# Altium project PCB_QrCodeMCU.PrjPcb (part 1 of 2)
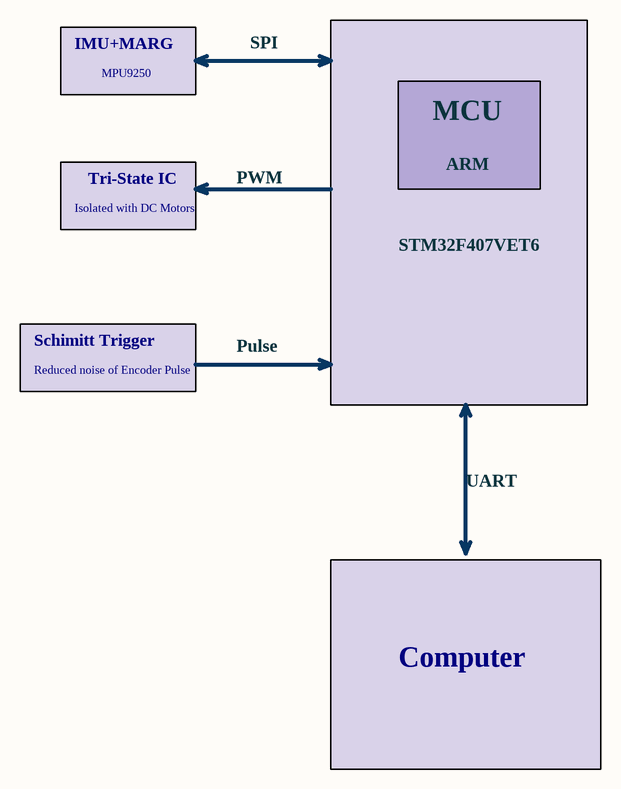
[diagram p0: Block_Diagram.SchDoc]
6 sheets, 101 parts. Net scope: flat (ports and power ports of the same name join across sheets).
Board file: PCB2.PcbDoc
Sheets:
  Block_Diagram.SchDoc
  PowerDiagram.SchDoc
  Power.SchDoc
  MCU.SchDoc
  Motor.SchDoc
  IMU.SchDoc

## Sheet Block_Diagram.SchDoc
size A; SheetNumber: 1; SheetTotal: 6

### Notes on the sheet
- IMU+MARG
- MPU9250
- SPI
- MCU
- ARM
- Isolated with DC Motors
- Tri-State IC
- PWM
- STM32F407VET6
- Schimitt Trigger
- Reduced noise of Encoder Pulse
- Pulse
- UART
- Computer

## Sheet PowerDiagram.SchDoc
size A; SheetNumber: 2; SheetTotal: 6
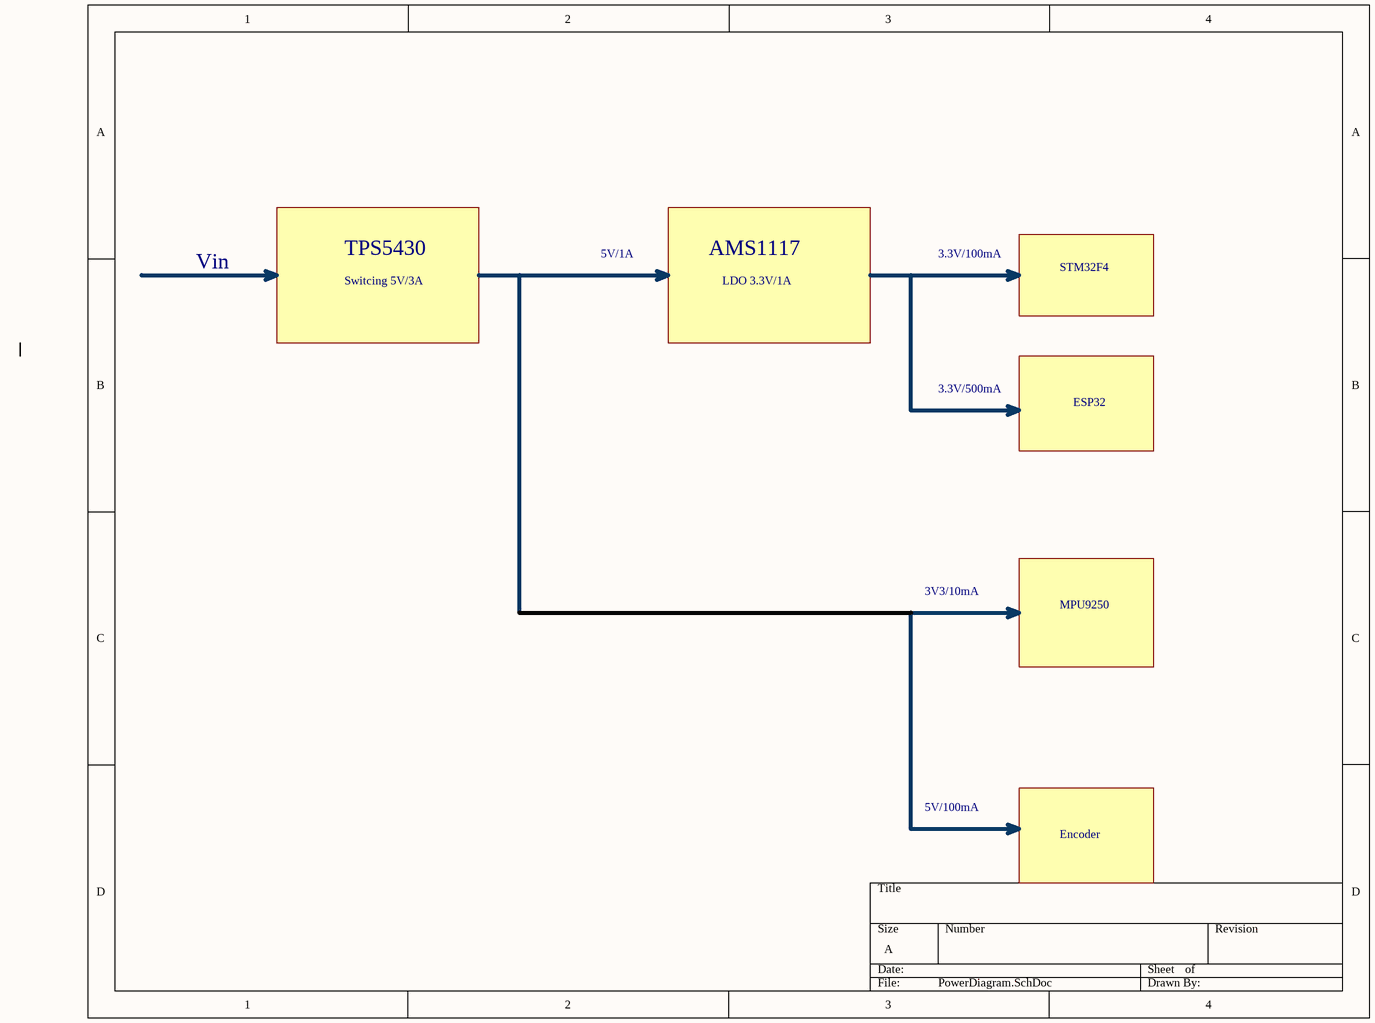
[diagram p1: PowerDiagram.SchDoc]

### Notes on the sheet
- Vin
- TPS5430
- Switcing 5V/3A
- 5V/1A
- AMS1117
- LDO 3.3V/1A
- 3.3V/100mA
- STM32F4
- 3.3V/500mA
- ESP32
- 3V3/10mA
- MPU9250
- 5V/100mA
- Encoder

## Sheet Power.SchDoc
size A3; SheetNumber: 3; SheetTotal: 6
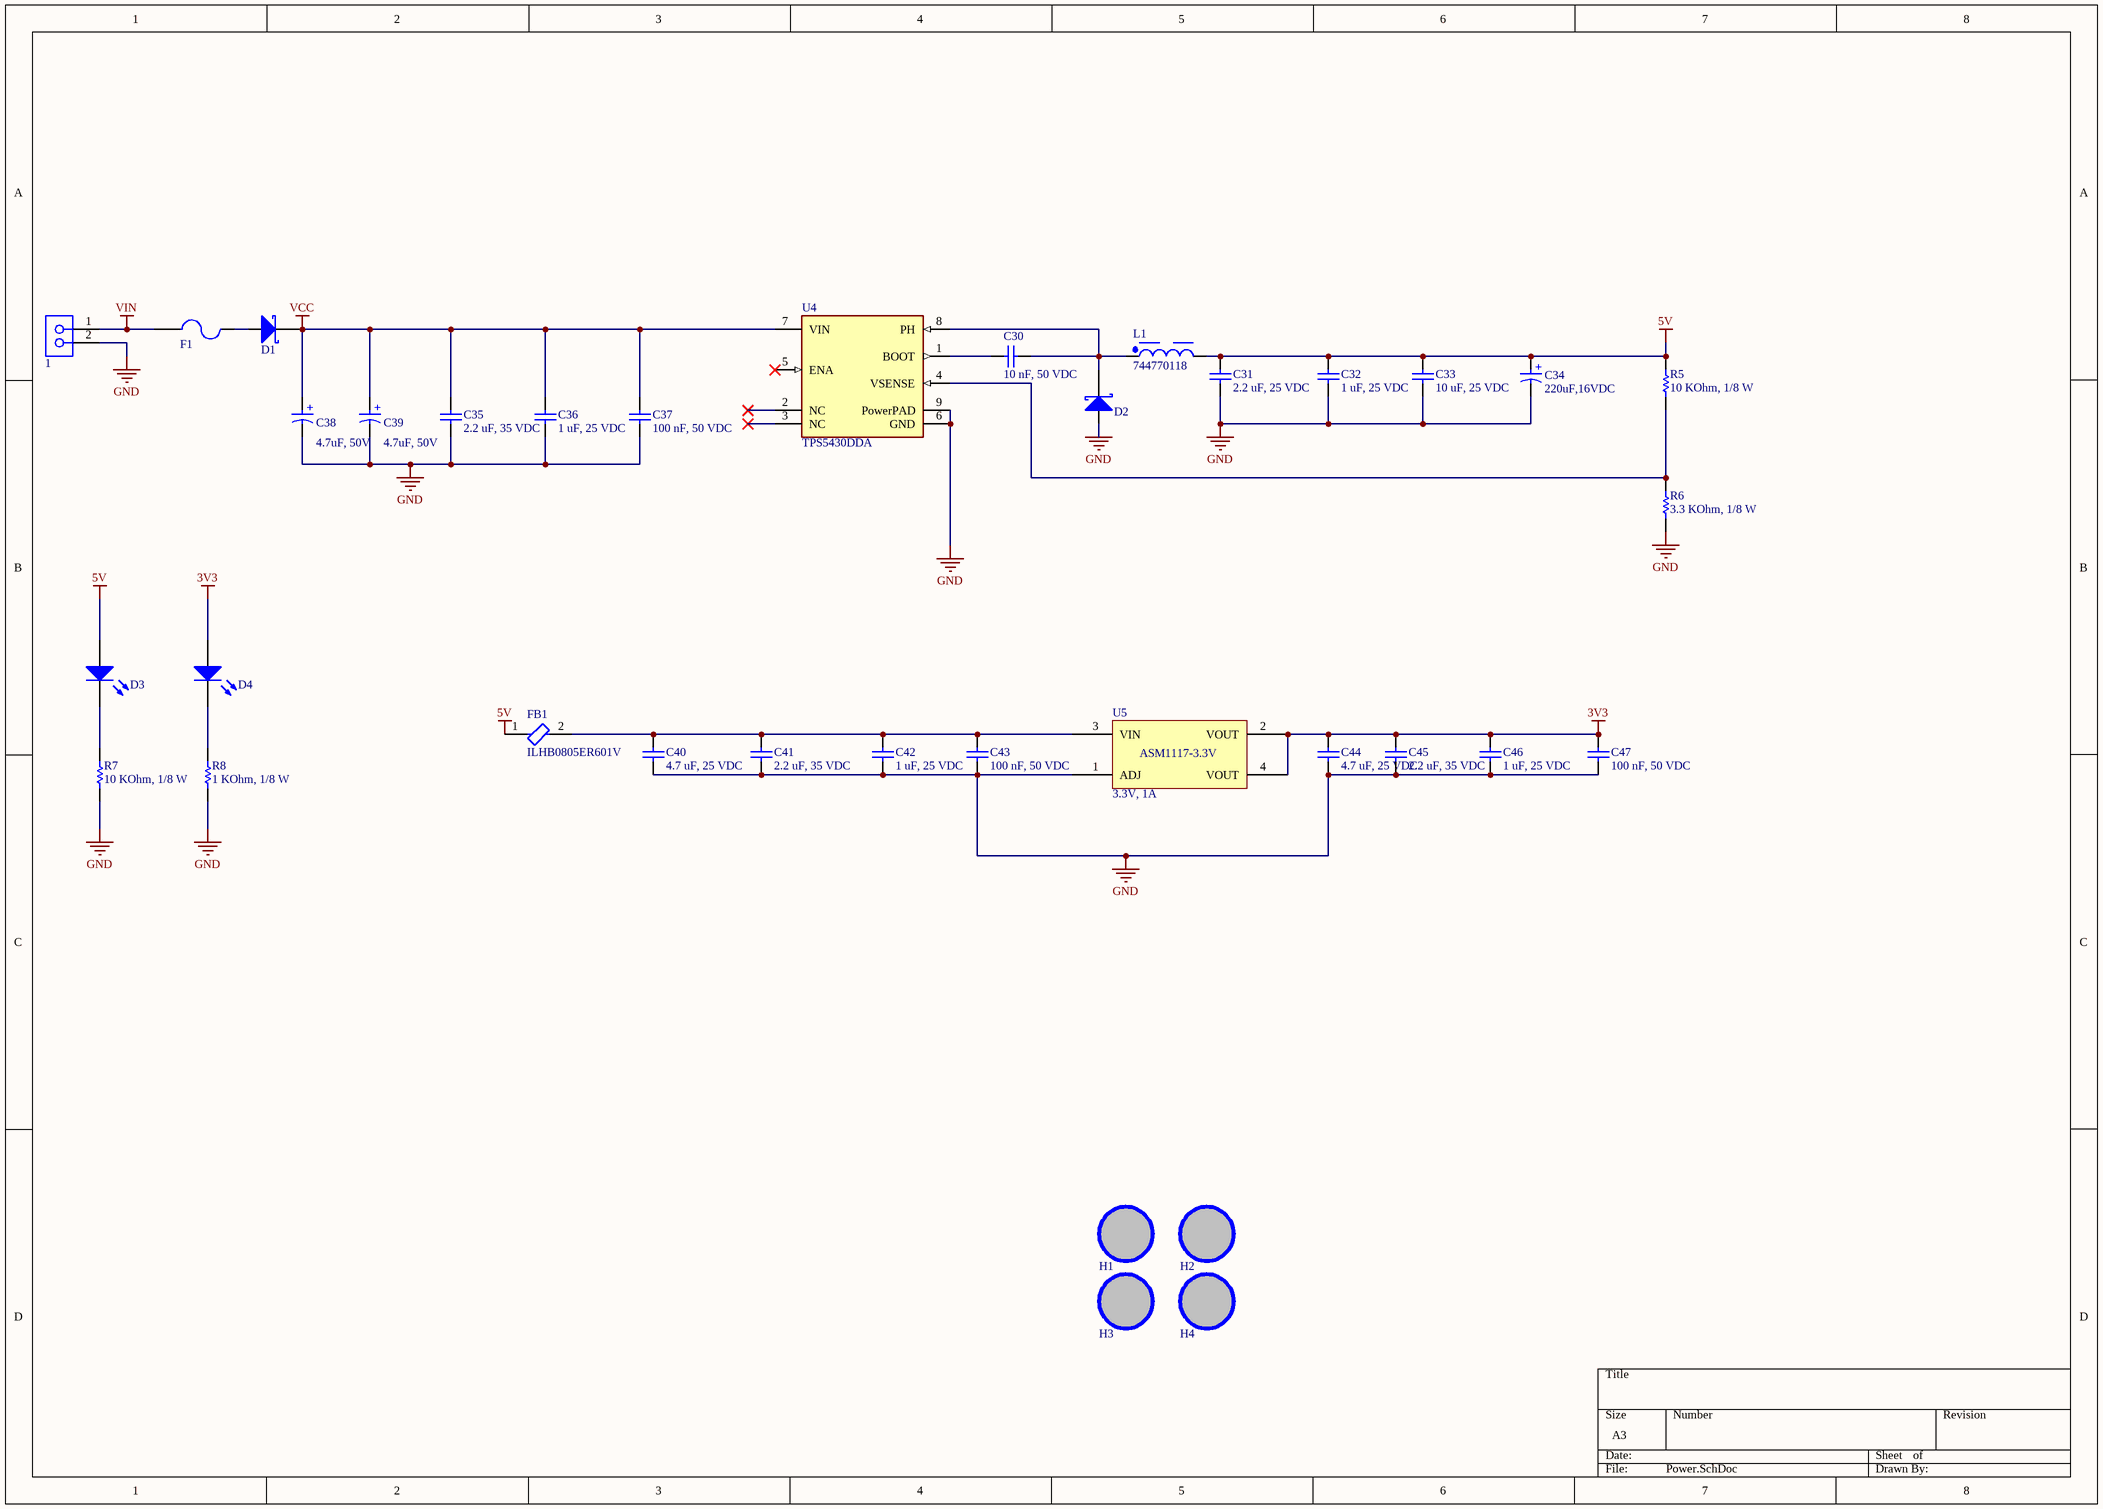
[diagram p2: Power.SchDoc]

### Parts
1  4A, 300V  [691418420002]  (value not drawn)
C30  10 nF, 50 VDC  [CAP_0805]
C31  2.2 uF, 25 VDC  [CAP_0805]
C32  1 uF, 25 VDC  [CAP_0805]
C33  10 uF, 25 VDC  [CAP_0805]
C34  220uF,16VDC  [WCAP-ASLI_D6.3H7.7]
C35  2.2 uF, 35 VDC  [CAP_0805]
C36  1 uF, 25 VDC  [CAP_0805]
C37  100 nF, 50 VDC  [CAP_0805]
C38  4.7uF, 50V  [WCAP-ASLI_D4H5.5]
C39  4.7uF, 50V  [WCAP-ASLI_D4H5.5]
C40  4.7 uF, 25 VDC  [CAP_0805]
C41  2.2 uF, 35 VDC  [CAP_0805]
C42  1 uF, 25 VDC  [CAP_0805]
C43  100 nF, 50 VDC  [CAP_0805]
C44  4.7 uF, 25 VDC  [CAP_0805]
C45  2.2 uF, 35 VDC  [CAP_0805]
C46  1 uF, 25 VDC  [CAP_0805]
C47  100 nF, 50 VDC  [CAP_0805]
D1  D Schottky  [SS34]  (value not drawn)
D2  D Schottky  [SS34]  (value not drawn)
D3  LED SMD  [LED_0805_Blue]  (value not drawn)
D4  LED SMD  [LED_0805_Blue]  (value not drawn)
F1  Fuse  [FUSE SMD]  (value not drawn)
FB1  ILHB0805ER601V  [FP-ILHB-0805-IPC_C]
H1  Hole  [LO KHOAN 3MM]  (value not drawn)
H2  Hole  [LO KHOAN 3MM]  (value not drawn)
H3  Hole  [LO KHOAN 3MM]  (value not drawn)
H4  Hole  [LO KHOAN 3MM]  (value not drawn)
L1  744770118  [WE-PD_1280]
R5  10 KOhm, 1/8 W  [RESISTOR_0805]
R6  3.3 KOhm, 1/8 W  [RESISTOR_0805]
R7  10 KOhm, 1/8 W  [RESISTOR_0805]
R8  1 KOhm, 1/8 W  [RESISTOR_0805]
U4  TPS5430DDA  [FP-DDA0008J-MFG]
U5  3.3V, 1A  [AMS1117-3.3V SOT223]

### Nets
3V3: C44.2 C45.2 C46.2 C47.2 D4.1(A) U5.2(VOUT) U5.4(VOUT)
5V: C31.2 C32.2 C33.2 C34.1(P) D3.1(A) FB1.1 L1.2 R5.2
GND: 1.2 C31.1 C32.1 C33.1 C34.2(N) C35.1 C36.1 C37.1 C38.2(N) C39.2(N) C40.1 C41.1 C42.1 C43.1 C44.1 C45.1 C46.1 C47.1 D2.1(A) R6.1 R7.1 R8.1 U4.6(GND) U4.9(PowerPAD) U5.1(ADJ)
VCC: C35.2 C36.2 C37.2 C38.1(P) C39.1(P) D1.2(K) U4.7(VIN)
VIN: 1.1 F1.1
NetC30_1: C30.1 D2.2(K) L1.1 U4.8(PH)
NetC30_2: C30.2 U4.1(BOOT)
NetC40_2: C40.2 C41.2 C42.2 C43.2 FB1.2 U5.3(VIN)
NetD1_1: D1.1(A) F1.2
NetD3_2: D3.2(K) R7.2
NetD4_2: D4.2(K) R8.2
NetR5_1: R5.1 R6.2 U4.4(VSENSE)

Not connected (* = marked no-connect by the designer): H1 1; H2 1; H3 1; H4 1; U4 2(NC)* 3(NC)* 5(ENA)*

### Notes on the sheet
- (in symbol 865080345012) +
- (in symbol 865080640004) +
- (in symbol AMS1117-3.3V) ASM1117-3.3V

### Library data of the parts
1 = 691418420002: WR-TBL Series 4184 45° Entry, THT, pitch 7.62mm, 2p; Manufacturer: Wurth Elektronik; Modularity: No; ComponentLink1Description: Datasheet Link; ComponentLink1URL: https://www.we-online.com/redexpert/spec/691418420002?ad; ComponentLink2Description: Supplier 1 URL; ComponentLink2URL: N/A; Manufacturer Part Number: 691418420002; Category: Terminal Blocks; Match Code: WR-TBL; Mount: Through Hole; Operating Temperature Max: 120°C; Operating Temperature Min: -30°C; Packaging: Box; Application: Screwless; Number of Pins: 2; Number of Rows: 1; Orientation: 45°; Pitch: 7.62mm; Rated Current: 4A; Working Voltage: 300V; ComponentLink3Description: Supplier 2 URL; ComponentLink3URL: N/A; ComponentLink4Description: Supplier 3 URL; ComponentLink4URL: https://www.thegioiic.com/hb762-2-terminal-khoi-han-pcb-2-cuc-24a-450v-7-62mm; Supplier 1 Name: Mouser; Supplier 1 SN: N/A; Supplier 1 URL: N/A; Supplier 2 Name: Digi-Key; Supplier 2 SN: N/A; Supplier 2 URL: N/A; Supplier 3 Name: thegioiic; Supplier 3 SN: N/A; Supplier 3 URL: https://www.thegioiic.com/hb762-2-terminal-khoi-han-pcb-2-cuc-24a-450v-7-62mm; Value: 4A, 300V
C30 = 0108051031050: CAP, size 0805, 10 nF, 50 VDC; Manufacture Name: TDK; Manufacture SN: CGA4C2C0G1H103J060AA; Capacitance: 10 nF; Tolerance: +/-5%; Voltage Rating DC: 50 VDC; ComponentLink2Description: Datasheet; ComponentLink2URL: https://product.tdk.com/system/files/dam/doc/product/capacitor/ceramic/mlcc/catalog/mlcc_automotive_general_en.pdf?ref_disty=mouser; Operating Temperature: -55 to +125degC; Packaging: Tape and Reel; Mounting Technology: SMT; Size: 0805; Supplier 1 Name: Mouser; Supplier 1 SN: 810-CGA4C2C0G1H103J; Supplier 1 URL: https://www.mouser.vn/ProductDetail/TDK/CGA4C2C0G1H103J060AA?qs=FxQuwy19cyC9M6v0nMqjhA%3D%3D&utm_source=mouser-refine-download&utm_medium=file&utm_campaign=CGA4C2C0G1H103J060AA&utm_content=TDK; Supplier 2 Name: Digi-Key; Supplier 2 SN: 445-6947-2-ND; Supplier 2 URL: https://www.digikey.com/en/products/detail/tdk-corporation/cga4c2c0g1h103j060aa/2672840; Supplier 3 Name: thegioiic; Supplier 3 SN: OEM; Supplier 3 URL: N/A; Value: 10 nF, 50 VDC
C31 = 0108052251025: CAP, size 0805, 2.2 uF, 25 VDC; Manufacture Name: TDK; Manufacture SN: CGA4J3X7R1E225K125AD; Capacitance: 2.2 uF; Tolerance: +/-10%; Voltage Rating DC: 25 VDC; ComponentLink2Description: Datasheet; ComponentLink2URL: https://product.tdk.com/system/files/dam/doc/product/capacitor/ceramic/mlcc/catalog/mlcc_automotive_epoxy_en.pdf?ref_disty=mouser; Operating Temperature: -55 to +125degC; Packaging: Tape and Reel; Mounting Technology: SMT; Size: 0805; Supplier 1 Name: Mouser; Supplier 1 SN: 810-CGA4J3X7R1E225KD; Supplier 1 URL: https://www.mouser.vn/ProductDetail/TDK/CGA4J3X7R1E225K125AD?qs=xLDY6iXSiQZ6drRfaPQTzQ%3D%3D&utm_source=mouser-refine-download&utm_medium=file&utm_campaign=CGA4J3X7R1E225K125AD&utm_content=TDK; Supplier 2 Name: Digi-Key; Supplier 2 SN: 445-9923-2-ND; Supplier 2 URL: https://www.digikey.com/en/products/detail/tdk-corporation/cga4j3x7r1e225k125ad/3933656; Supplier 3 Name: thegioiic; Supplier 3 SN: OEM; Supplier 3 URL: N/A; Value: 2.2 uF, 25 VDC
C32 C36 C42 C46 = 0108051051025: CAP, size 0805, 1 uF, 25 VDC; Manufacture Name: TDK; Manufacture SN: CGA4J1X8R1E105K125AE; Capacitance: 1 uF; Tolerance: +/-10%; Voltage Rating DC: 25 VDC; ComponentLink2Description: Datasheet; ComponentLink2URL: https://product.tdk.com/system/files/dam/doc/product/capacitor/ceramic/mlcc/catalog/mlcc_automotive_soft_en.pdf?ref_disty=mouser; Operating Temperature: -55 to +125degC; Packaging: Tape and Reel; Mounting Technology: SMT; Size: 0805; Supplier 1 Name: Mouser; Supplier 1 SN: 810-A4J1X815K125AE; Supplier 1 URL: https://www.mouser.vn/ProductDetail/TDK/CGA4J1X8R1E105K125AE?qs=Ii670aiJhr6VRhkBsruYJg%3D%3D&utm_source=mouser-refine-download&utm_medium=file&utm_campaign=CGA4J1X8R1E105K125AE&utm_content=TDK; Supplier 2 Name: Digi-Key; Supplier 2 SN: 445-174807-2-ND; Supplier 2 URL: https://www.digikey.com/en/products/detail/tdk-corporation/cga4j1x8r1e105k125ae/6556490; Supplier 3 Name: thegioiic; Supplier 3 SN: OEM; Supplier 3 URL: N/A; Value: 1 uF, 25 VDC
C33 = 0108051061025: CAP, size 0805, 10 uF, 25 VDC; Manufacture Name: TDK; Manufacture SN: CGA4J1X7S1E106K125AE; Capacitance: 10 uF; Tolerance: +/-10%; Voltage Rating DC: 25 VDC; ComponentLink2Description: Datasheet; ComponentLink2URL: https://product.tdk.com/system/files/dam/doc/product/capacitor/ceramic/mlcc/catalog/mlcc_automotive_soft_en.pdf?ref_disty=mouser; Operating Temperature: -55 to +125degC; Packaging: Tape and Reel; Mounting Technology: SMT; Size: 0805; Supplier 1 Name: Mouser; Supplier 1 SN: 810-CGA4J1X7S1E106K2; Supplier 1 URL: https://www.mouser.vn/ProductDetail/TDK/CGA4J1X7S1E106K125AE?qs=PqoDHHvF64%252BJvhmUzM2odA%3D%3D&utm_source=mouser-refine-download&utm_medium=file&utm_campaign=CGA4J1X7S1E106K125AE&utm_content=TDK; Supplier 2 Name: Digi-Key; Supplier 2 SN: 445-181411-2-ND; Supplier 2 URL: https://www.digikey.com/en/products/detail/tdk-corporation/cga4j1x7s1e106k125ae/9744777; Supplier 3 Name: thegioiic; Supplier 3 SN: OEM; Supplier 3 URL: N/A; Value: 10 uF, 25 VDC
C34 = 865080345012: V-Chip, D6.3 x H7.7mm, 220uF, 16V; Manufacturer: Wurth Elektronik; Capacitance Tolerance: +/-20%; Dissipation Factor: 16%; Endurance: 2000h; Leakage Current: 35.2uA; Ripple Current: 275mA; Category: Aluminum Electrolytic Capacitors; ComponentLink2Description: Datasheet Link; ComponentLink2URL: https://www.we-online.com/redexpert/spec/865080345012?ad; Mount: Surface Mount; Operating Temperature Max: 105°C; Operating Temperature Min: -55°C; Packaging: Tape and Reel; Height: 7.7mm; Diameter: 6.3mm; Capacitance: 220uF; Rated Voltage (DC): 16V; Supplier 1 Name: Mouser; Supplier 1 SN: 710-865080345012; Supplier 1 URL: https://www.mouser.com/ProductDetail/Wurth-Elektronik/865080345012?qs=0KOYDY2FL28fdpLe2qFZOQ%3D%3D; Supplier 3 Name: thegioiic; Supplier 3 URL: https://www.thegioiic.com/tu-nhom-smd-220uf-16v-6-3x7-7mm; Manufacturer Part Number: N/A; Supplier 2 Name: Digi-Key; Supplier 2 SN: N/A; Supplier 2 URL: N/A; Supplier 3 SN: N/A; Value: 220uF, 16V
C35 C41 C45 = 0108052251035: CAP, size 0805, 2.2 uF, 35 VDC; Manufacture Name: TDK; Manufacture SN: CGA4J1X7R1V225K125AC; Capacitance: 2.2 uF; Tolerance: +/-10%; Voltage Rating DC: 35 VDC; ComponentLink2Description: Datasheet; ComponentLink2URL: https://product.tdk.com/system/files/dam/doc/product/capacitor/ceramic/mlcc/catalog/mlcc_automotive_general_en.pdf?ref_disty=mouser; Operating Temperature: -55 to +125degC; Packaging: Tape and Reel; Mounting Technology: SMT; Size: 0805; Supplier 1 Name: Mouser; Supplier 1 SN: 810-CGA4J1X7R1V225K; Supplier 1 URL: https://www.mouser.vn/ProductDetail/TDK/CGA4J1X7R1V225K125AC?qs=NRhsANhppD%2FTd0jz18r29g%3D%3D&utm_source=mouser-refine-download&utm_medium=file&utm_campaign=CGA4J1X7R1V225K125AC&utm_content=TDK; Supplier 2 Name: Digi-Key; Supplier 2 SN: 445-6963-2-ND; Supplier 2 URL: https://www.digikey.com/en/products/detail/tdk-corporation/cga4j1x7r1v225k125ac/2672856; Supplier 3 Name: thegioiic; Supplier 3 SN: OEM; Supplier 3 URL: N/A; Value: 2.2 uF, 35 VDC
C37 C43 C47 = 0108051041050: CAP, size 0805, 100 nF, 50 VDC; Manufacture Name: TDK; Manufacture SN: CGA4J2X8R1H104K125AD; Capacitance: 0.1 nF; Tolerance: +/-10%; Voltage Rating DC: 50 VDC; Value: 0.1 nF, 50 VDC; ComponentLink2Description: Datasheet; ComponentLink2URL: https://product.tdk.com/system/files/dam/doc/product/capacitor/ceramic/mlcc/catalog/mlcc_automotive_epoxy_en.pdf?ref_disty=mouser; Operating Temperature: -55 to +125degC; Packaging: Tape and Reel; Mounting Technology: SMT; Size: 0805; Supplier 1 Name: Mouser; Supplier 1 SN: 810-C2012X8R1H104KEP; Supplier 1 URL: https://www.mouser.vn/ProductDetail/TDK/CGA4J2X8R1H104K125AD?qs=LcTL%2F5vFEzExqZqv3rh1qQ%3D%3D&utm_source=mouser-refine-download&utm_medium=file&utm_campaign=CGA4J2X8R1H104K125AD&utm_content=TDK; Supplier 2 Name: Digi-Key; Supplier 2 SN: 445-8810-2-ND; Supplier 2 URL: https://www.digikey.com/en/products/detail/tdk-corporation/cga4j2x8r1h104k125ad/3248169; Supplier 3 Name: thegioiic; Supplier 3 SN: OEM; Supplier 3 URL: N/A
C38 C39 = 865080640004: V-Chip, D4 x H5.5mm, 4.7uF, 50V; Manufacturer: Wurth Elektronik; Capacitance Tolerance: +/-20%; Dissipation Factor: 12%; Endurance: 2000h; Leakage Current: 3uA; Ripple Current: 55mA; Category: Aluminum Electrolytic Capacitors; ComponentLink2Description: Datasheet Link; ComponentLink2URL: https://www.we-online.com/redexpert/spec/865080640004?ad; Mount: Surface Mount; Operating Temperature Max: 105°C; Operating Temperature Min: -55°C; Packaging: Tape and Reel; Height: 5.5mm; Diameter: 4mm; Capacitance: 4.7uF; Rated Voltage (DC): 50V; Supplier 1 Name: Mouser; Supplier 1 SN: 710-865080640004; Supplier 1 URL: https://www.mouser.vn/ProductDetail/Wurth-Elektronik/865080640004?qs=0KOYDY2FL2%2FjY4kqBxIvAg%3D%3D; Supplier 3 Name: thegioiic; Supplier 3 URL: https://www.thegioiic.com/product/tu-hoa-nhom?prid=6714,5972; Manufacturer Part Number: N/A; Supplier 2 Name: Digi-Key; Supplier 2 SN: N/A; Supplier 2 URL: N/A; Supplier 3 SN: N/A; Value: 4.7uF, 50V
C40 C44 = 0108054751025: CAP, size 0805, 4.7 uF, 25 VDC; Manufacture Name: TDK; Manufacture SN: CGA4J1X8L1E475K125AC; Capacitance: 4.7 uF; Tolerance: +/-10%; Voltage Rating DC: 25 VDC; ComponentLink2Description: Datasheet; ComponentLink2URL: https://product.tdk.com/system/files/dam/doc/product/capacitor/ceramic/mlcc/catalog/mlcc_automotive_hightemp_en.pdf?ref_disty=mouser; Operating Temperature: -55 to +125degC; Packaging: Tape and Reel; Mounting Technology: SMT; Size: 0805; Supplier 1 Name: Mouser; Supplier 1 SN: 810-CGA4J1X8L1E125AC; Supplier 1 URL: https://www.mouser.vn/ProductDetail/TDK/CGA4J1X8L1E475K125AC?qs=gZXFycFWdANxpKJOMQuJTA%3D%3D&utm_source=mouser-refine-download&utm_medium=file&utm_campaign=CGA4J1X8L1E475K125AC&utm_content=TDK; Supplier 2 Name: Digi-Key; Supplier 2 SN: 445-181605-2-ND; Supplier 2 URL: https://www.digikey.com/en/products/detail/tdk-corporation/cga4j1x8l1e475k125ac/9991390; Supplier 3 Name: thegioiic; Supplier 3 SN: OEM; Supplier 3 URL: N/A; Value: 4.7 uF, 25 VDC
D1 D2 = D Schottky: Schottky Diode; Published: 8-Jun-2000; LatestRevisionDate: 17-Jul-2002; LatestRevisionNote: Re-released for DXP Platform.; PackageReference: SMB; Publisher: Altium Limited; PackageDescription: DO-214-AA/SMB; 2 C-Bend Leads; Body 5.3 x 3.6 mm, inc. leads (LxW); Code_JEDEC: DO-214-AA
D3 D4 = LED SMD: LED
FB1 = CMP-02428-000001-1: FERRITE BEAD 600 OHM 0805 1LN; Manufacturer: Vishay; Tolerance: 25%; Shielding: true; Test Frequency: 100MHz; Impedance At Frequency: 600Ω @ 100MHz; Series Resistance: 0.1Ω; Rms Current: 2000mA; ComponentLink2URL: http://www.vishay.com/docs/34102/ilhb.pdf; Octopart: https://octopart.com/ilhb0805er601v-vishay-39650184; Automotive: No; Height: 1.1mm; Mouser Description: Ferrite Beads Multi-Layer High Current 600Ohm 25% 100MHz 2A 100mOhm DCR 0805 T/R; ComponentLink2Description: Datasheet; Device Class L2: EMI / RFI Components; Lead Free: Yes; Ipc Land Pattern Name: CAPC200125X90; Package: ILHB-0805; Manufacturer Part Number: ILHB0805ER601V; Device Class L1: Passive Components; Digikey Description: FERRITE BEAD 600 OHM 0805 1LN; Category: FBead; Temperature Range High: +125°C; Temperature: -55°C to +125°C; RoHS: TRUE; Temperature Range Low: -55°C; Device Class L3: Ferrite Beads and Chips
H1-H4 = Hole: Hole 3mm
L1 = CMP-0227-00203-2: NexarPartId: 22866872; Inductance Tolerance: 20%; Inductance: 18µH; DC Resistance (DCR): 25mΩ; Current Rating: 5A; Self Resonant Frequency: 13.2MHz; Resistance: 32mΩ; Ambient Temperature Range Low: -40°C; Min Operating Temperature: -40°C; Ambient Temperature Range High: 85°C; Max Operating Temperature: 125°C; Height: 8mm; Packaging: Cut Tape (CT); Number of Pins: 2; Width: 12mm; Length: 12mm; RoHS: Compliant
R5 = 0008051035: RES, size 0805, 10 KOhm, 1/8 W; Manufacture  Name: Vishay Dale; Manufacture  SN: CRCW080510K0JNEAC; Resistance tolerance: +/-5%; Rated Power: 1/8 W; Resistance: 10 KOhm; Size: 0805; Mounting Technology: SMT; Supplier 1 Name: Mouser; Supplier 1 SN: 71-CRCW080510K0JNEB; Supplier 1 URL: https://www.mouser.vn/ProductDetail/Vishay-Dale/CRCW080510K0JNEB?qs=LOX6nxTstiZ5fn9YUdHx5A%3D%3D; Supplier 2 Name: Digi-Key; Supplier 2 SN: 541-4163-2-ND; Supplier 2 URL: https://www.digikey.com/en/products/detail/vishay-dale/CRCW080510K0JNEAC/7928585; Supplier 3 Name: Thegioiic; Supplier 3 SN: N/A; Supplier 3 URL: N/A; Value: 10 KOhm, 1/8 W; ComponentLink1Description: Datasheet link; ComponentLink1URL: https://www.vishay.com/docs/28773/crcwce3.pdf; ComponentLink2Description: Supplier 1 URL; ComponentLink2URL: https://www.mouser.vn/ProductDetail/Vishay-Dale/CRCW080510K0JNEB?qs=LOX6nxTstiZ5fn9YUdHx5A%3D%3D; ComponentLink3Description: Supplier 2 URL; ComponentLink3URL: https://www.digikey.com/en/products/detail/vishay-dale/CRCW080510K0JNEAC/7928585; ComponentLink4Description: Supplier 3 URL; ComponentLink4URL: N/A
R6 = 0008053325: RES, size 0805, 3.3 KOhm, 1/8 W; Manufacture  Name: Panasonic; Manufacture  SN: ERJ-S06J332V; Resistance tolerance: +/-5%; Rated Power: 1/8 W; Size: 0805; Mounting Technology: SMT; Resistance: 3.3 KOhm; Supplier 1 Name: Mouser; Supplier 1 SN: 667-ERJ-S06J332V; Supplier 1 URL: https://www.mouser.vn/ProductDetail/Panasonic/ERJ-S06J332V?qs=Lnc17S3XxqC89pwdWk%2FMHQ%3D%3D; Supplier 2 Name: Digi-Key; Supplier 2 SN: P3.3KATR-ND - Tape & Reel (TR); Supplier 2 URL: https://www.digikey.com/en/products/detail/panasonic-electronic-components/ERJ-6GEYJ332V/83038; Supplier 3 Name: Thegioiic; Supplier 3 SN: N/A; Supplier 3 URL: https://www.thegioiic.com/dien-tro-3-3-kohm-0805-5; Value: 3.3 KOhm, 1/8 W; ComponentLink1Description: Datasheet link; ComponentLink1URL: https://www.mouser.vn/datasheet/2/315/AOA0000C334-1314047.pdf; ComponentLink2Description: Supplier 1 URL; ComponentLink2URL: https://www.mouser.vn/ProductDetail/Panasonic/ERJ-S06J332V?qs=Lnc17S3XxqC89pwdWk%2FMHQ%3D%3D; ComponentLink3Description: Supplier 2 URL; ComponentLink3URL: https://www.digikey.com/en/products/detail/panasonic-electronic-components/ERJ-6GEYJ332V/83038; ComponentLink4Description: Supplier 3 URL; ComponentLink4URL: https://www.thegioiic.com/dien-tro-3-3-kohm-0805-5
R7 = 0008051031: RES, size 0805, 10 KOhm, 1/8 W; Resistance tolerance: +/-1%; Rated Power: 1/8 W; Resistance: 10 KOhm; Size: 0805; Mounting Technology: SMT; Supplier 1 Name: Mouser; Supplier 1 SN: N/A; Supplier 1 URL: N/A; Supplier 2 Name: Digi-Key; Supplier 2 SN: N/A; Supplier 2 URL: N/A; Supplier 3 Name: Thegioiic; Supplier 3 SN: N/A; Supplier 3 URL: https://www.thegioiic.com/dien-tro-1-kohm-0805-1; Manufacture  Name: N/A; Manufacture  SN: N/A; Value: 10 KOhm, 1/8 W; ComponentLink1Description: Datasheet link; ComponentLink1URL: N/A; ComponentLink2Description: Supplier 1 URL; ComponentLink2URL: N/A; ComponentLink3Description: Supplier 2 URL; ComponentLink3URL: N/A; ComponentLink4Description: Supplier 3 URL; ComponentLink4URL: https://www.thegioiic.com/dien-tro-1-kohm-0805-1
R8 = 0008051025: RES, size 0805, 1 KOhm, 1/8 W; Manufacture  Name: Vishay Dale; Manufacture  SN: CRCW08051K00JNEAC; Resistance tolerance: +/-5%; Rated Power: 1/8 W; Resistance: 1 KOhm; Size: 0805; Mounting Technology: SMT; Supplier 1 Name: Mouser; Supplier 1 SN: 71-CRCW08051K00JNEC; Supplier 1 URL: https://www.mouser.vn/ProductDetail/Vishay-Dale/CRCW08051K00JNEC?qs=OW6ROCK%252BaiZqKFsNe9zjFw%3D%3D; Supplier 2 Name: Digi-Key; Supplier 2 SN: 541-4162-2-ND; Supplier 2 URL: https://www.digikey.com/en/products/detail/vishay-dale/CRCW08051K00JNEAC/7928584; Supplier 3 Name: Thegioiic; Supplier 3 SN: N/A; Supplier 3 URL: https://www.thegioiic.com/dien-tro-1-kohm-0805-5-; Value: 1 KOhm, 1/8 W; ComponentLink1Description: Datasheet link; ComponentLink1URL: https://www.vishay.com/docs/28773/crcwce3.pdf; ComponentLink2Description: Supplier 1 URL; ComponentLink2URL: https://www.mouser.vn/ProductDetail/Vishay-Dale/CRCW08051K00JNEC?qs=OW6ROCK%252BaiZqKFsNe9zjFw%3D%3D; ComponentLink3Description: Supplier 2 URL; ComponentLink3URL: https://www.digikey.com/en/products/detail/vishay-dale/CRCW08051K00JNEAC/7928584; ComponentLink4Description: Supplier 3 URL; ComponentLink4URL: https://www.thegioiic.com/dien-tro-1-kohm-0805-5-
U4 = CMP-2000-04960-2: IC REG BUCK ADJUSTABLE 3A 8SOPWR; Manufacturer: Texas Instruments; Max Junction Temp: +125°C; Max Supply Voltage: 36V; Switching Frequency: 500kHz; Output Type: AdjustableProgrammable; Standoff Height: 0mm; Output Voltage: 1.23-31V; Max Duty Cycle: 89%; Nominal Supply Current: 3mA; Min Supply Voltage: 5.5V; Number Of Outputs: 1; Temperature: -40°C to +125°C; Temperature Range High: +125°C; Manufacturer Part Number: TPS5430DDA; Device Class L3: Voltage Regulators - Switching; Mouser Description: Voltage Regulators - Switching Regulators 5.5 to 36V Input 3A Step Dwn Converter; Switching Topology: Buck; ComponentLink2URL: http://www.ti.com/lit/ds/symlink/tps5431.pdf; ComponentLink2Description: Datasheet; Device Class L2: Power Management ICs; Device Class L1: Integrated Circuits (ICs); Digikey Description: IC REG BUCK ADJUSTABLE 3A 8SOPWR; RoHS: TRUE; Octopart: https://octopart.com/tps5430dda-texas+instruments-589977; Output Current: 3A; Automotive: No; Lead Free: Yes; Category: IC; Package: DDA0008J; Temperature Range Low: -40°C; Height: 1.7mm
U5 = AMS1117-3.3V: AMS1117-3.3V, OUT 3.3V 1A.; Manufacturer: AMS; Pad Count: 4; Voltage Input Maximum: 15V; Manufacturer Part Number: N/A; Current Input Maximum: N/A; Current Output Maximum: 1A; Supplier 1 Name: Mouser; Supplier 2 Name: Digi-Key; Supplier 3 Name: thegioiic; Voltage Output: 3.3V; Mounting Technology: SMD; ComponentLink1Description: Datasheet link; ComponentLink1URL: http://www.advanced-monolithic.com/pdf/ds1117.pdf; ComponentLink2Description: Supplier 1 URL; ComponentLink2URL: N/A; ComponentLink3Description: Supplier 2 URL; ComponentLink3URL: N/A; ComponentLink4Description: Supplier 3 URL; ComponentLink4URL: N/A; Supplier 1 SN: N/A; Supplier 1 URL: N/A; Supplier 2 SN: N/A; Supplier 2 URL: N/A; Supplier 3 SN: N/A; Supplier 3 URL: https://www.thegioiic.com/ams1117-3-3v-ic-on-ap-3-3v-1a-sot-223; Value: 3.3V, 1A

## Sheet MCU.SchDoc
size A3; SheetNumber: 4; SheetTotal: 6
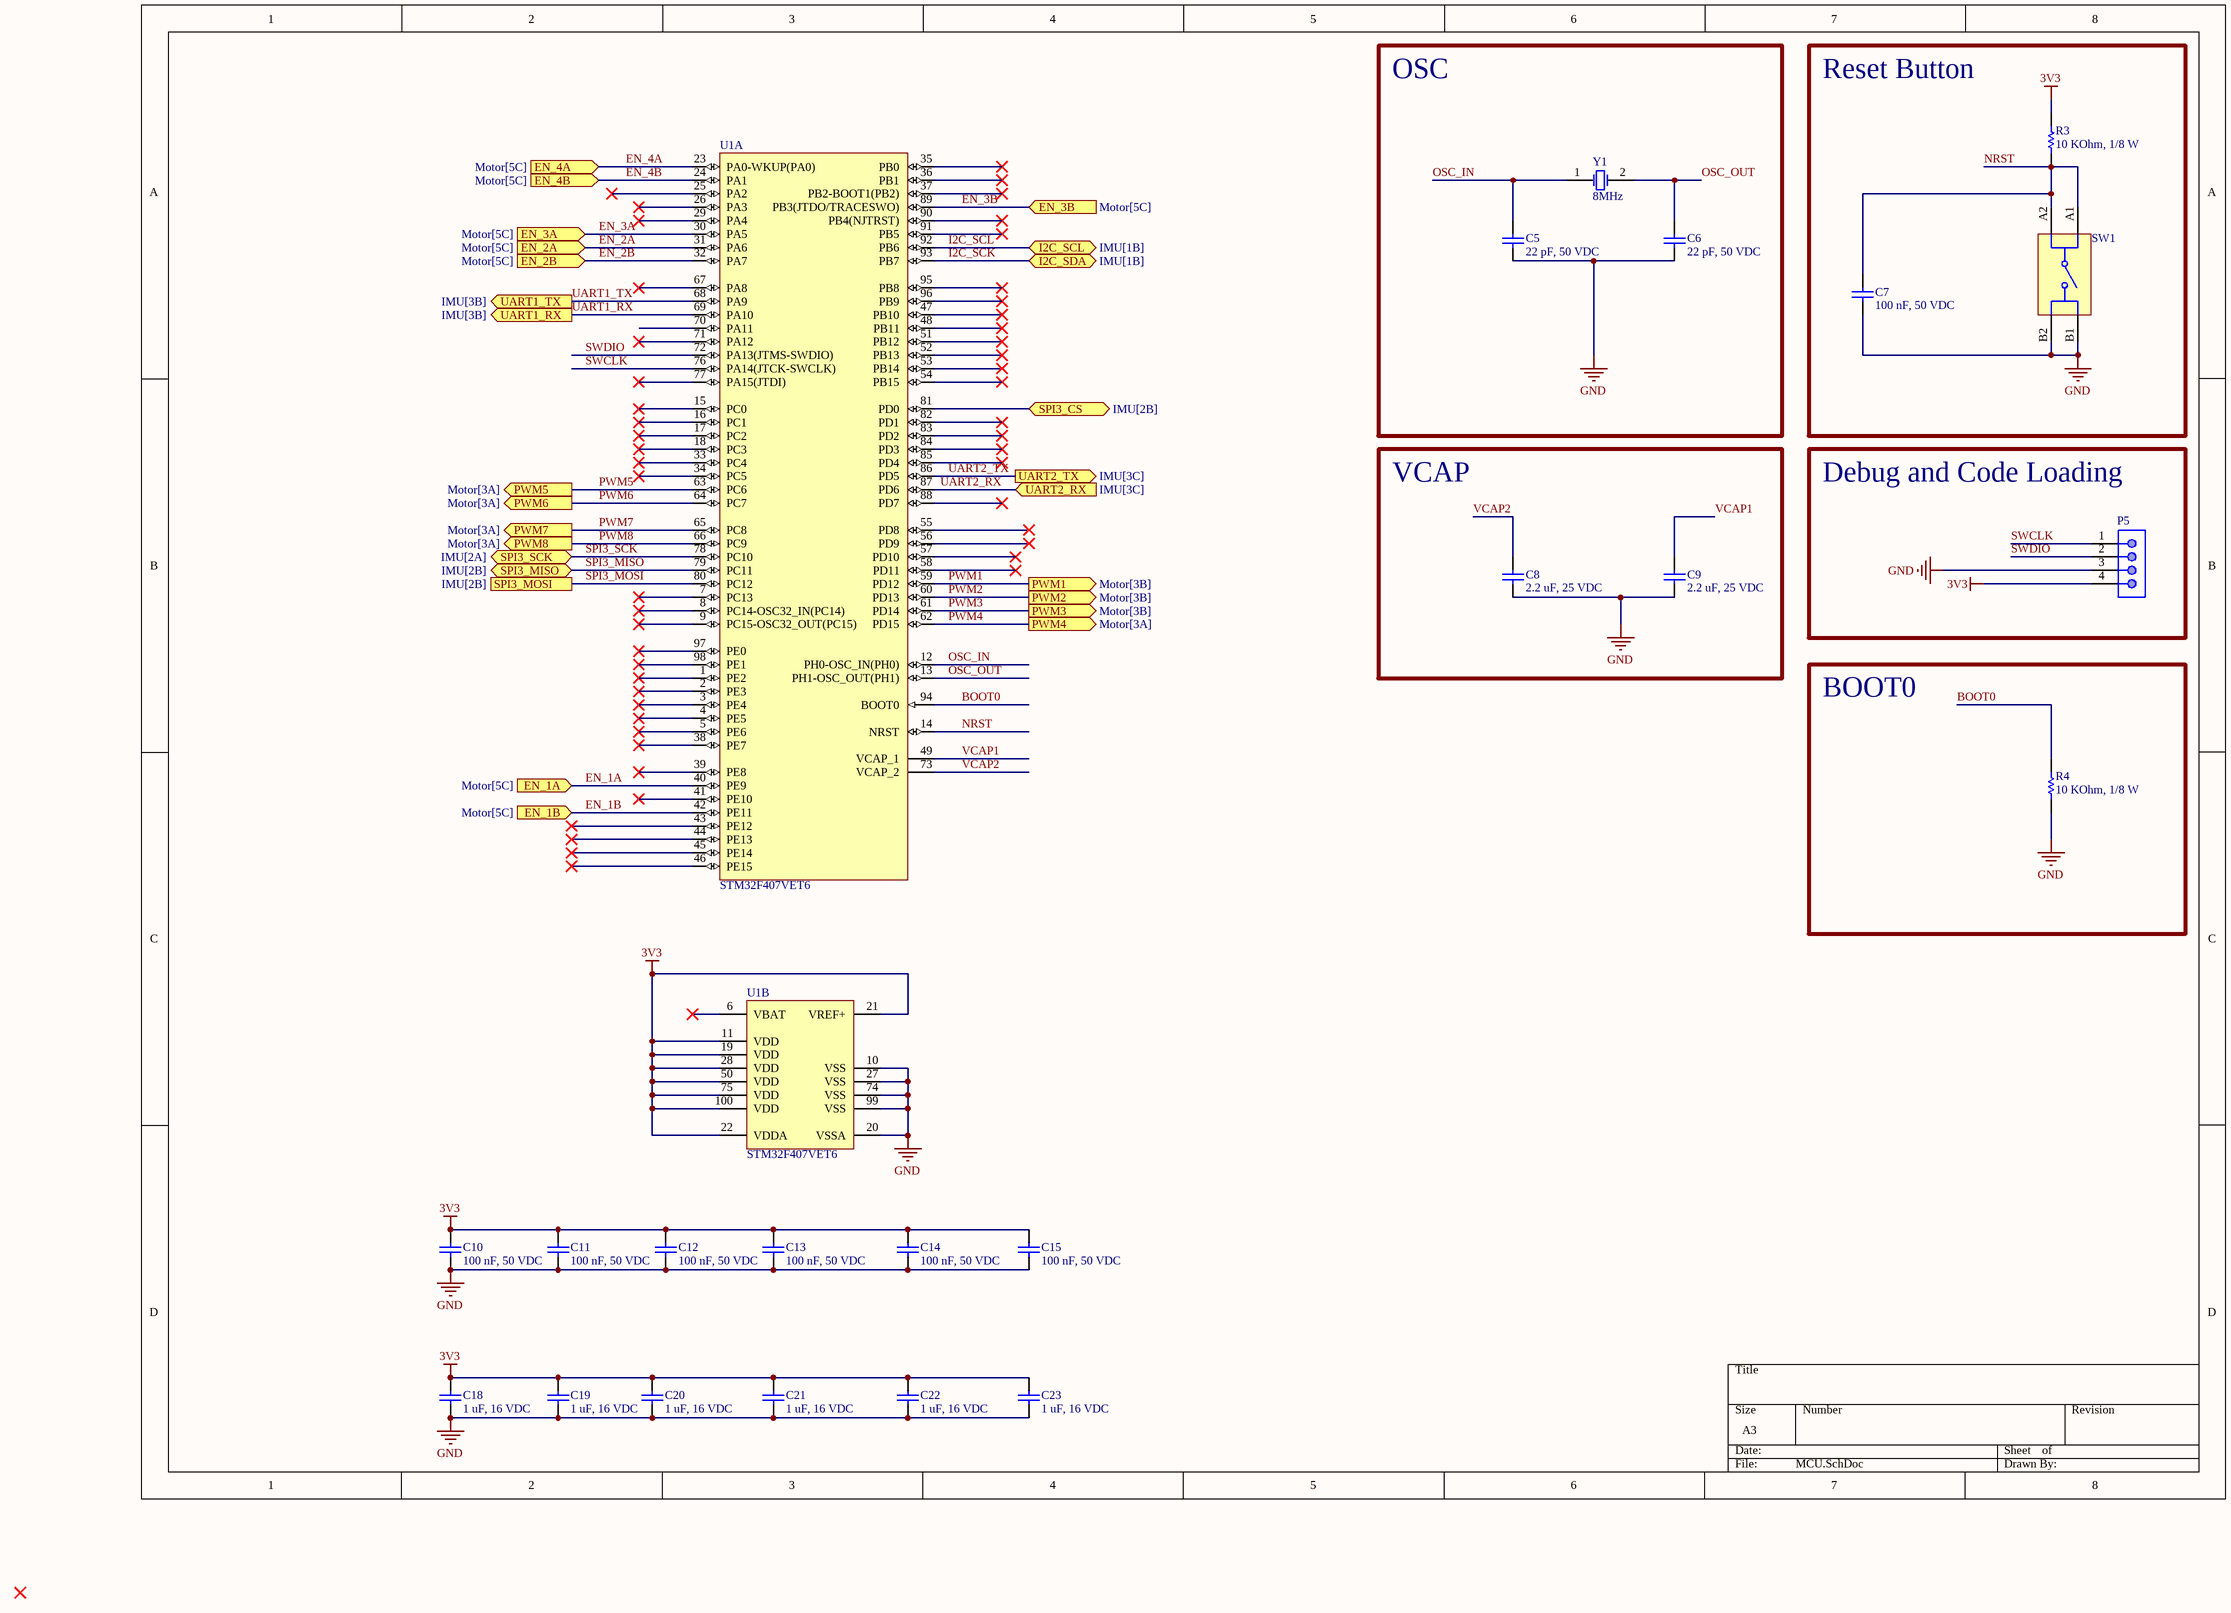
[diagram p3: MCU.SchDoc]

### Parts
C5  22 pF, 50 VDC  [CAP_0805]
C6  22 pF, 50 VDC  [CAP_0805]
C7  100 nF, 50 VDC  [CAP_0805]
C8  2.2 uF, 25 VDC  [CAP_0805]
C9  2.2 uF, 25 VDC  [CAP_0805]
C10  100 nF, 50 VDC  [CAP_0805]
C11  100 nF, 50 VDC  [CAP_0805]
C12  100 nF, 50 VDC  [CAP_0805]
C13  100 nF, 50 VDC  [CAP_0805]
C14  100 nF, 50 VDC  [CAP_0805]
C15  100 nF, 50 VDC  [CAP_0805]
C18  1 uF, 16 VDC  [CAP_0805]
C19  1 uF, 16 VDC  [CAP_0805]
C20  1 uF, 16 VDC  [CAP_0805]
C21  1 uF, 16 VDC  [CAP_0805]
C22  1 uF, 16 VDC  [CAP_0805]
C23  1 uF, 16 VDC  [CAP_0805]
P5  61300411121  [61300411121]  (value not drawn)
R3  10 KOhm, 1/8 W  [RESISTOR_0805]
R4  10 KOhm, 1/8 W  [RESISTOR_0805]
SW1  430483035816  [WS-TASV_L6W6H3.5_4304x30358x6]  (value not drawn)
U1  STM32F407VET6  [STM-LQFP100_V]  (parts A,B of 2)
Y1  8MHz  [WE-XTAL_HC49/4HSMX]

### Blocks framed on the sheet
OSC: C5 C6 Y1
Reset Button: C7 R3 SW1
VCAP: C8 C9
Debug and Code Loading: P5
BOOT0: R4

### Ports
EN_1A (in, see Motor[5C]), EN_1B (in, see Motor[5C]), EN_2A (in, see Motor[5C]), EN_2B (in, see Motor[5C]), EN_3A (in, see Motor[5C]), EN_3B (in, see Motor[5C]), EN_4A (in, see Motor[5C]), EN_4B (in, see Motor[5C]), I2C_SCL (bidir, see IMU[1B]), I2C_SDA (bidir, see IMU[1B]), PWM1 (out, see Motor[3B]), PWM2 (out, see Motor[3B]), PWM3 (out, see Motor[3B]), PWM4 (out, see Motor[3A]), PWM5 (out, see Motor[3A]), PWM6 (out, see Motor[3A]), PWM7 (out, see Motor[3A]), PWM8 (out, see Motor[3A]), SPI3_CS (bidir, see IMU[2B]), SPI3_MISO (bidir, see IMU[2B]), SPI3_MOSI (see IMU[2B]), SPI3_SCK (bidir, see IMU[2A]), UART1_RX (out, see IMU[3B]), UART1_TX (out, see IMU[3B]), UART2_RX (in, see IMU[3C]), UART2_TX (out, see IMU[3C])

### Nets
3V3: C10.2 C11.2 C12.2 C13.2 C14.2 C15.2 C18.2 C19.2 C20.2 C21.2 C22.2 C23.2 P5.4 R3.2 U1.11(VDD) U1.19(VDD) U1.21(VREF+) U1.22(VDDA) U1.28(VDD) U1.50(VDD) U1.75(VDD) U1.100(VDD)
GND: C5.1 C6.1 C7.1 C8.1 C9.1 C10.1 C11.1 C12.1 C13.1 C14.1 C15.1 C18.1 C19.1 C20.1 C21.1 C22.1 C23.1 P5.3 R4.1 SW1.B1 SW1.B2 U1.10(VSS) U1.20(VSSA) U1.27(VSS) U1.74(VSS) U1.99(VSS)
BOOT0: R4.2 U1.94(BOOT0)
EN_1A: U1.40(PE9) ; port EN_1A
EN_1B: U1.42(PE11) ; port EN_1B
EN_2A: U1.31(PA6) ; port EN_2A
EN_2B: U1.32(PA7) ; port EN_2B
EN_3A: U1.30(PA5) ; port EN_3A
EN_3B: U1.89(PB3(JTDO/TRACESWO)) ; port EN_3B
EN_4A: U1.23(PA0-WKUP(PA0)) ; port EN_4A
EN_4B: U1.24(PA1) ; port EN_4B
I2C_SCK: U1.93(PB7) ; port I2C_SDA
I2C_SCL: U1.92(PB6) ; port I2C_SCL
NRST: C7.2 R3.1 SW1.A1 SW1.A2 U1.14(NRST)
OSC_IN: C5.2 U1.12(PH0-OSC_IN(PH0)) Y1.1(OSC1)
OSC_OUT: C6.2 U1.13(PH1-OSC_OUT(PH1)) Y1.2(OSC2)
PWM1: U1.59(PD12) ; port PWM1
PWM2: U1.60(PD13) ; port PWM2
PWM3: U1.61(PD14) ; port PWM3
PWM4: U1.62(PD15) ; port PWM4
PWM5: U1.63(PC6) ; port PWM5
PWM6: U1.64(PC7) ; port PWM6
PWM7: U1.65(PC8) ; port PWM7
PWM8: U1.66(PC9) ; port PWM8
SPI3_MISO: U1.79(PC11) ; port SPI3_MISO
SPI3_MOSI: U1.80(PC12) ; port SPI3_MOSI
SPI3_SCK: U1.78(PC10) ; port SPI3_SCK
SWCLK: P5.1 U1.76(PA14(JTCK-SWCLK))
SWDIO: P5.2 U1.72(PA13(JTMS-SWDIO))
UART1_RX: U1.69(PA10) ; port UART1_RX
UART1_TX: U1.68(PA9) ; port UART1_TX
UART2_RX: U1.87(PD6) ; port UART2_RX
UART2_TX: U1.86(PD5) ; port UART2_TX
VCAP1: C9.2 U1.49(VCAP_1)
VCAP2: C8.2 U1.73(VCAP_2)
NetJ1_9: U1.81(PD0) ; port SPI3_CS

Not connected (* = marked no-connect by the designer): U1 1(PE2)* 2(PE3)* 3(PE4)* 4(PE5)* 5(PE6)* 6(VBAT)* 7(PC13)* 8(PC14-OSC32_IN(PC14))* 9(PC15-OSC32_OUT(PC15))* 15(PC0)* 16(PC1)* 17(PC2)* 18(PC3)* 25(PA2)* 26(PA3)* 29(PA4)* 33(PC4)* 34(PC5)* 35(PB0)* 36(PB1)* 37(PB2-BOOT1(PB2))* 38(PE7)* 39(PE8)* 41(PE10)* 43(PE12)* 44(PE13)* 45(PE14)* 46(PE15)* 47(PB10)* 48(PB11)* 51(PB12)* 52(PB13)* 53(PB14)* 54(PB15)* 55(PD8)* 56(PD9)* 57(PD10)* 58(PD11)* 67(PA8)* 70(PA11) 71(PA12)* 77(PA15(JTDI))* 82(PD1)* 83(PD2)* 84(PD3)* 85(PD4)* 88(PD7)* 90(PB4(NJTRST))* 91(PB5)* 95(PB8)* 96(PB9)* 97(PE0)* 98(PE1)*

### Library data of the parts
C5 C6 = 0108052231050: CAP, size 0805, 22 pF, 50 VDC; Manufacture Name: TDK; Manufacture SN: CGA4J2C0G1H223J125AA; Capacitance: 22 nF; Tolerance: +/-5%; Voltage Rating DC: 50 VDC; Value: 22 nF, 50 VDC; ComponentLink2Description: Datasheet; ComponentLink2URL: https://product.tdk.com/system/files/dam/doc/product/capacitor/ceramic/mlcc/catalog/mlcc_automotive_general_en.pdf?ref_disty=mouser; Operating Temperature: -55 to +125degC; Packaging: Tape and Reel; Mounting Technology: SMT; Size: 0805; Supplier 1 Name: Mouser; Supplier 1 SN: 810-CGA4J2C0G1H223J; Supplier 1 URL: https://www.mouser.vn/ProductDetail/TDK/CGA4J2C0G1H223J125AA?qs=NRhsANhppD%252B%2Fmt276RAXag%3D%3D&utm_source=mouser-refine-download&utm_medium=file&utm_campaign=CGA4J2C0G1H223J125AA&utm_content=TDK; Supplier 2 Name: Digi-Key; Supplier 2 SN: 445-6949-2-ND; Supplier 2 URL: https://www.digikey.com/en/products/detail/tdk-corporation/cga4j2c0g1h223j125aa/2672842; Supplier 3 Name: thegioiic; Supplier 3 SN: OEM; Supplier 3 URL: N/A
C7 = 0108051541050: CAP, size 0805, 100 nF, 50 VDC; Manufacture Name: TDK; Manufacture SN: CGA4J2X7R1H154K125AD; Capacitance: 150 nF; Tolerance: +/-10%; Voltage Rating DC: 50 VDC; Value: 150 nF, 50 VDC; ComponentLink2Description: Datasheet; ComponentLink2URL: https://product.tdk.com/system/files/dam/doc/product/capacitor/ceramic/mlcc/catalog/mlcc_automotive_epoxy_en.pdf?ref_disty=mouser; Operating Temperature: -55 to +125degC; Packaging: Tape and Reel; Mounting Technology: SMT; Size: 0805; Supplier 1 Name: Mouser; Supplier 1 SN: 810-CGA4J2X7R1H154KD; Supplier 1 URL: https://www.mouser.vn/ProductDetail/TDK/CGA4J2X7R1H154K125AD?qs=xLDY6iXSiQYlxmVq9lRXDA%3D%3D&utm_source=mouser-refine-download&utm_medium=file&utm_campaign=CGA4J2X7R1H154K125AD&utm_content=TDK; Supplier 2 Name: Digi-Key; Supplier 2 SN: 445-9929-2-ND; Supplier 2 URL: https://www.digikey.com/en/products/detail/tdk-corporation/cga4j2x7r1h154k125ad/3933662; Supplier 3 Name: thegioiic; Supplier 3 SN: OEM; Supplier 3 URL: N/A
C8 C9 = 0108052251025: as C31 on sheet Power; ComponentLink2Description: Datasheet; ComponentLink2URL: https://product.tdk.com/system/files/dam/doc/product/capacitor/ceramic/mlcc/catalog/mlcc_automotive_epoxy_en.pdf?ref_disty=mouser; Operating Temperature: -55 to +125degC; Packaging: Tape and Reel; Mounting Technology: SMT; Size: 0805; Supplier 1 Name: Mouser; Supplier 1 SN: 810-CGA4J3X7R1E225KD; Supplier 1 URL: https://www.mouser.vn/ProductDetail/TDK/CGA4J3X7R1E225K125AD?qs=xLDY6iXSiQZ6drRfaPQTzQ%3D%3D&utm_source=mouser-refine-download&utm_medium=file&utm_campaign=CGA4J3X7R1E225K125AD&utm_content=TDK; Supplier 2 Name: Digi-Key; Supplier 2 SN: 445-9923-2-ND; Supplier 2 URL: https://www.digikey.com/en/products/detail/tdk-corporation/cga4j3x7r1e225k125ad/3933656; Supplier 3 Name: thegioiic; Supplier 3 SN: OEM; Supplier 3 URL: N/A; Value: 2.2 uF, 25 VDC
C10-C15 = 0108051031050: CAP, size 0805, 100 nF, 50 VDC; Manufacture Name: TDK; Manufacture SN: CGA4C2C0G1H103J060AA; Capacitance: 10 nF; Tolerance: +/-5%; Voltage Rating DC: 50 VDC; Value: 10 nF, 50 VDC; ComponentLink2Description: Datasheet; ComponentLink2URL: https://product.tdk.com/system/files/dam/doc/product/capacitor/ceramic/mlcc/catalog/mlcc_automotive_general_en.pdf?ref_disty=mouser; Operating Temperature: -55 to +125degC; Packaging: Tape and Reel; Mounting Technology: SMT; Size: 0805; Supplier 1 Name: Mouser; Supplier 1 SN: 810-CGA4C2C0G1H103J; Supplier 1 URL: https://www.mouser.vn/ProductDetail/TDK/CGA4C2C0G1H103J060AA?qs=FxQuwy19cyC9M6v0nMqjhA%3D%3D&utm_source=mouser-refine-download&utm_medium=file&utm_campaign=CGA4C2C0G1H103J060AA&utm_content=TDK; Supplier 2 Name: Digi-Key; Supplier 2 SN: 445-6947-2-ND; Supplier 2 URL: https://www.digikey.com/en/products/detail/tdk-corporation/cga4c2c0g1h103j060aa/2672840; Supplier 3 Name: thegioiic; Supplier 3 SN: OEM; Supplier 3 URL: N/A
C18-C23 = 0108051051016: CAP, size 0805, 1 uF, 16 VDC; Manufacture Name: TDK; Manufacture SN: CGA4J2X7R1C105K125AA; Capacitance: 1 uF; Tolerance: +/-10%; Voltage Rating DC: 16 VDC; ComponentLink2Description: Datasheet; ComponentLink2URL: https://product.tdk.com/system/files/dam/doc/product/capacitor/ceramic/mlcc/catalog/mlcc_automotive_general_en.pdf?ref_disty=mouser; Operating Temperature: -55 to +125degC; Packaging: Tape and Reel; Mounting Technology: SMT; Size: 0805; Supplier 1 Name: Mouser; Supplier 1 SN: 810-CGA4J2X7R1C105K; Supplier 1 URL: https://www.mouser.vn/ProductDetail/TDK/CGA4J2X7R1C105K125AA?qs=NRhsANhppD8sFjo%252B1TQuCQ%3D%3D&utm_source=mouser-refine-download&utm_medium=file&utm_campaign=CGA4J2X7R1C105K125AA&utm_content=TDK; Supplier 2 Name: Digi-Key; Supplier 2 SN: 445-5689-2-ND; Supplier 2 URL: https://www.digikey.com/en/products/detail/tdk-corporation/cga4j2x7r1c105k125aa/2443167; Supplier 3 Name: thegioiic; Supplier 3 SN: OEM; Supplier 3 URL: N/A; Value: 1 uF, 16 VDC
P5 = 61300411121: WR-PHD Pin Header, THT, pitch 2.54mm, Single Row, Vertical, 4p; Manufacturer: Wurth Elektronik; Pin Number: 4; Rated Current: 3A; Working Voltage: 250VAC; Withstanding Voltage: 500VAC; Contact Resistance: 20mOhm; Supply Name 1: Mouser; ComponentLink1Description: Manufacturer; ComponentLink1URL: http://www.we-online.de; ComponentLink2Description: Datasheet; ComponentLink2URL: https://www.we-online.com/catalog/datasheet/61300411121.pdf; Manufacturer Part Number: 61300411121; Published Date: May 2020; Pitch: 2.54mm; Operating Temperature: -40 to +105degC; Mounting Technology: THT; Packaging: Bag; Gender: Pin Header; Row Number: Single; Orientation: Vertical; ComponentLink3Description: Global Supply; ComponentLink3URL: https://www.we-online.com/en/components/products/PHD_2_54_THT_PIN_HEADER_6130XX11121?sq=61300411121#61300411121; ComponentLink4Description: Global Supply; ComponentLink4URL: https://www.mouser.vn/ProductDetail/Wurth-Elektronik/61300411121?qs=PhR8RmCirEYQcLLqXD8rAA%3D%3D; Supplier 1 Name: Mouser; Supplier 1 SN: 710-61300311121; Supplier 1 URL: https://www.mouser.vn/ProductDetail/Wurth-Elektronik/61300311121?qs=PhR8RmCirEYxRWFJzNKsUw%3D%3D; Supplier 2 Name: Digi-Key; Supplier 2 SN: N/A; Supplier 2 URL: N/A; Supplier 3 Name: thegioiic; Supplier 3 SN: N/A; Supplier 3 URL: N/A
R3 R4 = 0008051031: as R7 on sheet Power; Size: 0805; Mounting Technology: SMT; Supplier 1 Name: Mouser; Supplier 1 SN: N/A; Supplier 1 URL: N/A; Supplier 2 Name: Digi-Key; Supplier 2 SN: N/A; Supplier 2 URL: N/A; Supplier 3 Name: Thegioiic; Supplier 3 SN: N/A; Supplier 3 URL: https://www.thegioiic.com/dien-tro-1-kohm-0805-1; Manufacture  Name: N/A; Manufacture  SN: N/A; Value: 10 KOhm, 1/8 W; ComponentLink1Description: Datasheet link; ComponentLink1URL: N/A; ComponentLink2Description: Supplier 1 URL; ComponentLink2URL: N/A; ComponentLink3Description: Supplier 2 URL; ComponentLink3URL: N/A; ComponentLink4Description: Supplier 3 URL; ComponentLink4URL: https://www.thegioiic.com/dien-tro-1-kohm-0805-1
SW1 = 430483035816: WS-TASV J-Bend SMT Washable Tact Switch, 12VDC, 50mA, 160g, height 3.5mm; Manufacturer: Wurth Elektronik; Rated Voltage: 12V; Washable: Yes; Actuator Color: Black; Electrical Life: 1000000Cycles; ComponentLink1Description: Manufacturer Link; ComponentLink1URL: http://www.we-online.de; ComponentLink2Description: Datasheet; ComponentLink2URL: https://www.we-online.com/catalog/datasheet/430483035816.pdf; Manufacturer Part Number: 430483035816; Contact Material: Stainless Steel; Mounting Technology: SMT; Contact Plating: Silver; Operation Force: 160g; Packaging: Tape and Reel; Terminal Material: Copper Alloy; Rated Current: 50mA; Terminal Plating: Silver; Height: 3.5mm; Length: 6mm; Operating Temperature max.: 85C; Operating Temperature min.: -40C; Width: 6mm
U1 = CMP-0243-00016-3: ARM Cortex-M4 32-bit MCU+FPU, 210 DMIPS, 512 kB Flash, 192 kB Internal RAM, 82 I/Os, 100-pin LQFP, -40 to 85 degC, Tray; Manufacturer: STMicroelectronics; Supply Voltage(Vcc) max (V): 3.6; Supply Voltage(Vcc) min (V): 1.8; I/Os (High Current): 82; FLASH Size (Prog) (kB): 512; Operating Frequency(F) (Processor speed) (MHz): 168; D/A Converter: 2x12-bit; Internal RAM Size (kB): 192; PackageReference: LQFP100; Core: ARM Cortex-M4; ComponentLink1URL: http://www.st.com/web/en/home.html; ComponentLink1Description: Manufacturer URL; DatasheetVersion: Rev. 4; Packing: Tray; Mounting Technology: Surface Mount; ComponentLink2Description: Datasheet; ComponentLink2URL: http://www.st.com/st-web-ui/static/active/en/resource/technical/document/datasheet/DM00037051.pdf; ComponentLink3Description: Package Specification; PartNumber: STM32F407VET6; PackageVersion: Rev. 1, 06/2013; PackageDescription: 100-Pin Low Profile Quad Flat Package, 14 x 14 mm Body, 0.5 mm Pitch; ComponentLink3URL: http://www.st.com/st-web-ui/static/active/en/resource/technical/document/data_brief/DM00071938.pdf
Y1 = 071105086016: WE-XTAL Quartz Crystal, SMT, HC49/4HSMX, 8MHz, +/-30ppm; Manufacturer Part Number: 830003151; Manufacturer: Wurth Elektronik; Frequency Stability: +/-50ppm; Load Capacitance: 16pF; ComponentLink2Description: Supplier 1 URL; ComponentLink2URL: https://www.mouser.com/ProductDetail/Wurth-Elektronik/830003151?qs=2WXlatMagcHisY7XHApyYg%3D%3D; Operating Temperature: -10 to +60degC; Size: HC49/4HSMX; Frequency: 8MHz; Frequency Tolerance: +/-30ppm; Mounting Technology: SMT; Supplier 3 Name: thegioiic; Supplier 3 SN: N/A; Supplier 3 URL: https://www.thegioiic.com/thach-anh-8mhz-2-chan-smd-hc49-s; ComponentLink1Description: Datasheet link; ComponentLink1URL: https://katalog.we-online.com/pbs/datasheet/830003151.pdf; ComponentLink3Description: Supplier 2 URL; ComponentLink3URL: https://www.digikey.com/en/products/detail/w%C3%BCrth-elektronik/830003151/13979296; ComponentLink4Description: Supplier 3 URL; ComponentLink4URL: https://www.thegioiic.com/thach-anh-8mhz-2-chan-smd-hc49-s; Supplier 1 Name: Mouser; Supplier 1 SN: 710-830003151; Supplier 1 URL: https://www.mouser.com/ProductDetail/Wurth-Elektronik/830003151?qs=2WXlatMagcHisY7XHApyYg%3D%3D; Supplier 2 Name: Digi-Key; Supplier 2 SN: 732-830003151TR-ND; Supplier 2 URL: https://www.digikey.com/en/products/detail/w%C3%BCrth-elektronik/830003151/13979296; Value: 8MHz

## Sheet Motor.SchDoc
size A3; SheetNumber: 5; SheetTotal: 6
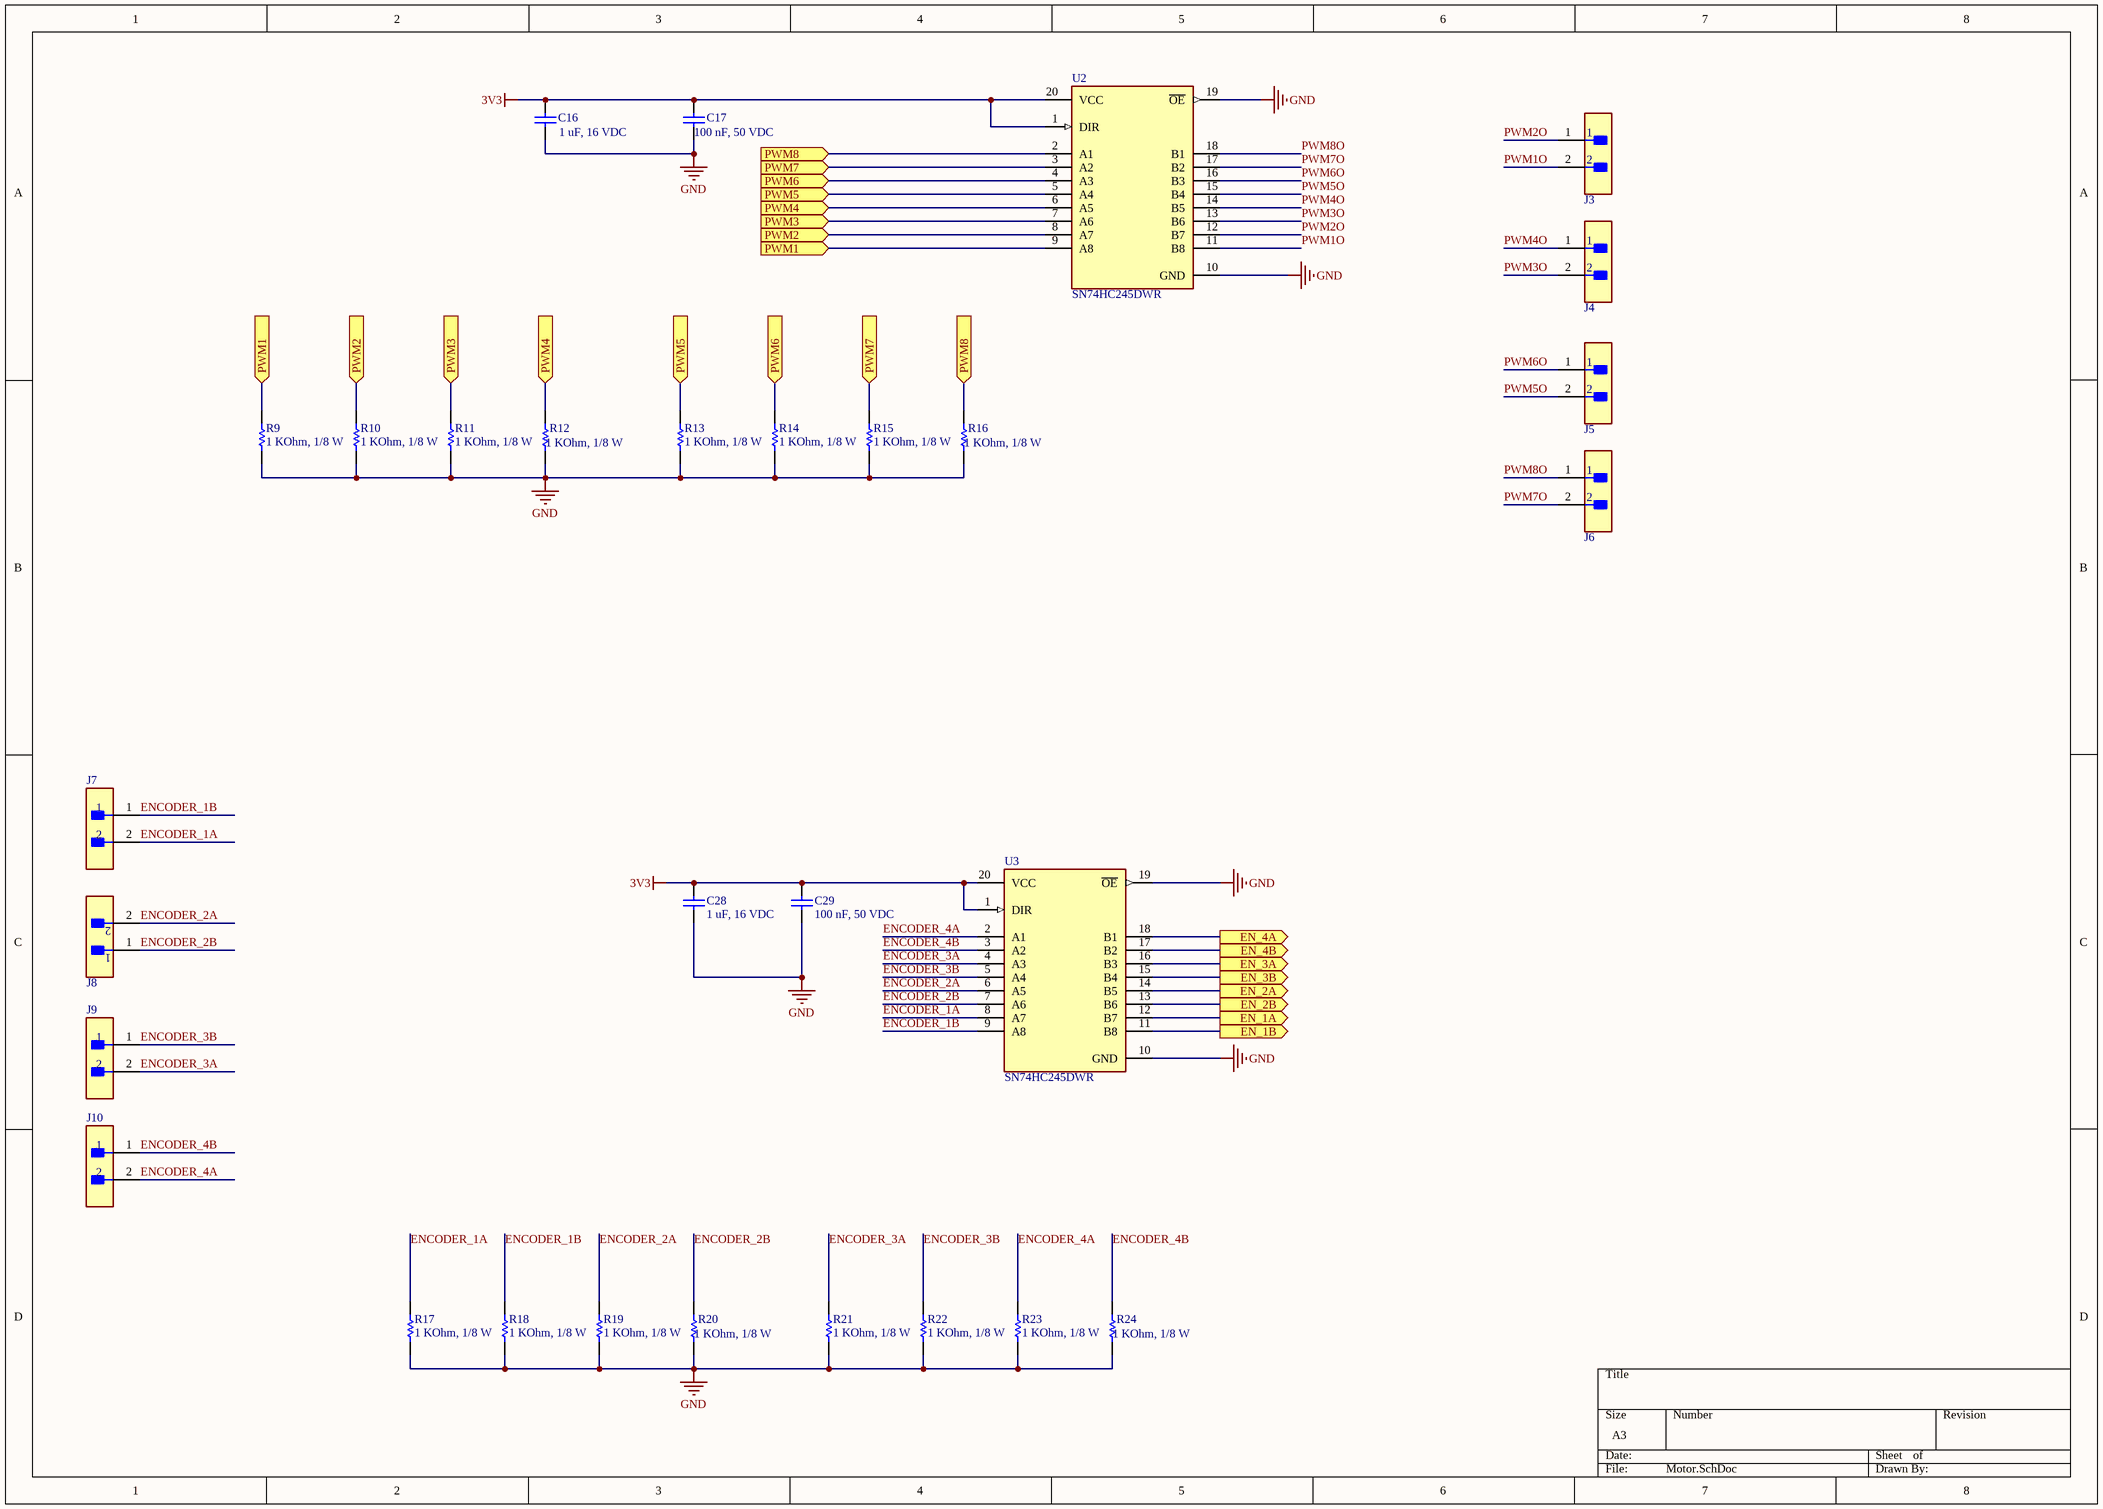
[diagram p4: Motor.SchDoc]

### Parts
C16  1 uF, 16 VDC  [CAP_0603]
C17  100 nF, 50 VDC  [CAP_0603]
C28  1 uF, 16 VDC  [CAP_0805]
C29  100 nF, 50 VDC  [CAP_0805]
J3  B2B-XH-A(LF)(SN)  [FP-B2B-XH-A_LF_SN-MFG]  (value not drawn)
J4  B2B-XH-A(LF)(SN)  [FP-B2B-XH-A_LF_SN-MFG]  (value not drawn)
J5  B2B-XH-A(LF)(SN)  [FP-B2B-XH-A_LF_SN-MFG]  (value not drawn)
J6  B2B-XH-A(LF)(SN)  [FP-B2B-XH-A_LF_SN-MFG]  (value not drawn)
J7  B2B-XH-A(LF)(SN)  [FP-B2B-XH-A_LF_SN-MFG]  (value not drawn)
J8  B2B-XH-A(LF)(SN)  [FP-B2B-XH-A_LF_SN-MFG]  (value not drawn)
J9  B2B-XH-A(LF)(SN)  [FP-B2B-XH-A_LF_SN-MFG]  (value not drawn)
J10  B2B-XH-A(LF)(SN)  [FP-B2B-XH-A_LF_SN-MFG]  (value not drawn)
R9  1 KOhm, 1/8 W  [RESISTOR_0805]
R10  1 KOhm, 1/8 W  [RESISTOR_0805]
R11  1 KOhm, 1/8 W  [RESISTOR_0805]
R12  1 KOhm, 1/8 W  [RESISTOR_0805]
R13  1 KOhm, 1/8 W  [RESISTOR_0805]
R14  1 KOhm, 1/8 W  [RESISTOR_0805]
R15  1 KOhm, 1/8 W  [RESISTOR_0805]
R16  1 KOhm, 1/8 W  [RESISTOR_0805]
R17  1 KOhm, 1/8 W  [RESISTOR_0805]
R18  1 KOhm, 1/8 W  [RESISTOR_0805]
R19  1 KOhm, 1/8 W  [RESISTOR_0805]
R20  1 KOhm, 1/8 W  [RESISTOR_0805]
R21  1 KOhm, 1/8 W  [RESISTOR_0805]
R22  1 KOhm, 1/8 W  [RESISTOR_0805]
R23  1 KOhm, 1/8 W  [RESISTOR_0805]
R24  1 KOhm, 1/8 W  [RESISTOR_0805]
U2  SN74HC245DWR  [FP-DW0020A-IPC_A]
U3  SN74HC245DWR  [FP-DW0020A-IPC_A]

### Ports
EN_1A (out, see MCU[2C]), EN_1B (out, see MCU[2C]), EN_2A (out, see MCU[2A]), EN_2B (out, see MCU[2A]), EN_3A (out, see MCU[2A]), EN_3B (out, see MCU[4A]), EN_4A (out, see MCU[2A]), EN_4B (out, see MCU[2A]), PWM1 (in, see MCU[4B], Motor[1B]), PWM1 (in, see MCU[4B], Motor[3A]), PWM2 (in, see MCU[4B], Motor[2B]), PWM2 (in, see MCU[4B], Motor[3A]), PWM3 (in, see MCU[4B], Motor[2B]), PWM3 (in, see MCU[4B], Motor[3A]), PWM4 (in, see MCU[4B], Motor[3A]), PWM4 (in, see MCU[4B], Motor[3B]), PWM5 (in, see MCU[2B], Motor[3A]), PWM5 (in, see MCU[2B], Motor[3B]), PWM6 (in, see MCU[2B], Motor[3A]), PWM6 (in, see MCU[2B], Motor[3B]), PWM7 (in, see MCU[2B], Motor[3A]), PWM7 (in, see MCU[2B], Motor[4B]), PWM8 (in, see MCU[2B], Motor[3A]), PWM8 (in, see MCU[2B], Motor[4B])

### Nets
3V3: C16.2 C17.2 C28.2 C29.2 U2.1(DIR) U2.20(VCC) U3.1(DIR) U3.20(VCC)
GND: C16.1 C17.1 C28.1 C29.1 R9.1 R10.1 R11.1 R12.1 R13.1 R14.1 R15.1 R16.1 R17.1 R18.1 R19.1 R20.1 R21.1 R22.1 R23.1 R24.1 U2.10(GND) U2.19(~{OE}) U3.10(GND) U3.19(~{OE})
EN_1A: U3.12(B7) ; port EN_1A
EN_1B: U3.11(B8) ; port EN_1B
EN_2A: U3.14(B5) ; port EN_2A
EN_2B: U3.13(B6) ; port EN_2B
EN_3A: U3.16(B3) ; port EN_3A
EN_3B: U3.15(B4) ; port EN_3B
EN_4A: U3.18(B1) ; port EN_4A
EN_4B: U3.17(B2) ; port EN_4B
ENCODER_1A: J7.2 R17.2 U3.8(A7)
ENCODER_1B: J7.1 R18.2 U3.9(A8)
ENCODER_2A: J8.2 R19.2 U3.6(A5)
ENCODER_2B: J8.1 R20.2 U3.7(A6)
ENCODER_3A: J9.2 R21.2 U3.4(A3)
ENCODER_3B: J9.1 R22.2 U3.5(A4)
ENCODER_4A: J10.2 R23.2 U3.2(A1)
ENCODER_4B: J10.1 R24.2 U3.3(A2)
PWM1: R9.2 U2.9(A8) ; port PWM1
PWM1O: J3.2 U2.11(B8)
PWM2: R10.2 U2.8(A7) ; port PWM2
PWM2O: J3.1 U2.12(B7)
PWM3: R11.2 U2.7(A6) ; port PWM3
PWM3O: J4.2 U2.13(B6)
PWM4: R12.2 U2.6(A5) ; port PWM4
PWM4O: J4.1 U2.14(B5)
PWM5: R13.2 U2.5(A4) ; port PWM5
PWM5O: J5.2 U2.15(B4)
PWM6: R14.2 U2.4(A3) ; port PWM6
PWM6O: J5.1 U2.16(B3)
PWM7: R15.2 U2.3(A2) ; port PWM7
PWM7O: J6.2 U2.17(B2)
PWM8: R16.2 U2.2(A1) ; port PWM8
PWM8O: J6.1 U2.18(B1)

### Library data of the parts
C16 = 0106031051016: CAP, size 0603, 1 uF, 16 VDC; Manufacture Name: Samsung Electro-Mechanics; Manufacture SN: CL10B105KO8NNWC; Capacitance: 1 uF; Tolerance: +/-10%; Voltage Rating DC: 16 VDC; ComponentLink2Description: Datasheet; ComponentLink2URL: https://www.mouser.vn/datasheet/2/585/Samsung_MLCC_1837944-1929650.pdf; Operating Temperature: -55 to +125degC; Packaging: Tape and Reel; Mounting Technology: SMT; Size: 0603; Supplier 1 Name: Mouser; Supplier 1 SN: 187-CL10B105KO8NNWC; Supplier 1 URL: https://www.mouser.vn/ProductDetail/Samsung-Electro-Mechanics/CL10B105KO8NNWC?qs=81r%252BiQLm7BT%252BXtc72qn1ug%3D%3D&utm_source=mouser-refine-download&utm_medium=file&utm_campaign=CL10B105KO8NNWC&utm_content=Samsung-Electro-Mechanics; Supplier 2 Name: Digi-Key; Supplier 2 SN: 1276-CL10B105KO8NNWCTR-ND; Supplier 2 URL: https://www.digikey.com/en/products/detail/samsung-electro-mechanics/cl10b105ko8nnwc/16572783; Supplier 3 Name: thegioiic; Supplier 3 SN: N/A; Supplier 3 URL: https://www.thegioiic.com/tu-gom-0603-1uf-16v; Value: 1 uF, 16 VDC
C17 = 0106031041050: CAP, size 0603, 100 nF, 50 VDC; Manufacture Name: TDK; Manufacture SN: CGA3E3X8R1H104K080AE; Capacitance: 100 nF; Tolerance: +/-10%; Voltage Rating DC: 50 VDC; ComponentLink2Description: Datasheet; ComponentLink2URL: https://product.tdk.com/system/files/dam/doc/product/capacitor/ceramic/mlcc/catalog/mlcc_automotive_soft_en.pdf?ref_disty=mouser; Operating Temperature: -55 to +125degC; Packaging: Tape and Reel; Mounting Technology: SMT; Size: 0603; Supplier 1 Name: Mouser; Supplier 1 SN: 810-CGA3E3X8R1H104KA; Supplier 1 URL: https://www.mouser.com/ProductDetail/TDK/CGA3E3X8R1H104K080AE?qs=nQSIdc08i%252Bd8g3IRRgU2bw%3D%3D&utm_source=mouser-refine-download&utm_medium=file&utm_campaign=CGA3E3X8R1H104K080AE&utm_content=TDK; Supplier 2 Name: Digi-Key; Supplier 2 SN: 445-173697-2-ND; Supplier 2 URL: https://www.digikey.com/en/products/detail/tdk-corporation/cga3e3x8r1h104k080ae/5809262; Supplier 3 Name: thegioiic; Supplier 3 SN: N/A; Supplier 3 URL: N/A; Value: 100 nF, 50 VDC
C28 = 0108051051016: as C18 on sheet MCU; ComponentLink2Description: Datasheet; ComponentLink2URL: https://product.tdk.com/system/files/dam/doc/product/capacitor/ceramic/mlcc/catalog/mlcc_automotive_general_en.pdf?ref_disty=mouser; Operating Temperature: -55 to +125degC; Packaging: Tape and Reel; Mounting Technology: SMT; Size: 0805; Supplier 1 Name: Mouser; Supplier 1 SN: 810-CGA4J2X7R1C105K; Supplier 1 URL: https://www.mouser.vn/ProductDetail/TDK/CGA4J2X7R1C105K125AA?qs=NRhsANhppD8sFjo%252B1TQuCQ%3D%3D&utm_source=mouser-refine-download&utm_medium=file&utm_campaign=CGA4J2X7R1C105K125AA&utm_content=TDK; Supplier 2 Name: Digi-Key; Supplier 2 SN: 445-5689-2-ND; Supplier 2 URL: https://www.digikey.com/en/products/detail/tdk-corporation/cga4j2x7r1c105k125aa/2443167; Supplier 3 Name: thegioiic; Supplier 3 SN: OEM; Supplier 3 URL: N/A; Value: 1 uF, 16 VDC
C29 = 0108051031050: as C10 on sheet MCU; ComponentLink2Description: Datasheet; ComponentLink2URL: https://product.tdk.com/system/files/dam/doc/product/capacitor/ceramic/mlcc/catalog/mlcc_automotive_general_en.pdf?ref_disty=mouser; Operating Temperature: -55 to +125degC; Packaging: Tape and Reel; Mounting Technology: SMT; Size: 0805; Supplier 1 Name: Mouser; Supplier 1 SN: 810-CGA4C2C0G1H103J; Supplier 1 URL: https://www.mouser.vn/ProductDetail/TDK/CGA4C2C0G1H103J060AA?qs=FxQuwy19cyC9M6v0nMqjhA%3D%3D&utm_source=mouser-refine-download&utm_medium=file&utm_campaign=CGA4C2C0G1H103J060AA&utm_content=TDK; Supplier 2 Name: Digi-Key; Supplier 2 SN: 445-6947-2-ND; Supplier 2 URL: https://www.digikey.com/en/products/detail/tdk-corporation/cga4c2c0g1h103j060aa/2672840; Supplier 3 Name: thegioiic; Supplier 3 SN: OEM; Supplier 3 URL: N/A
J3-J10 = CMP-2000-05888-3: CONN HEADER VERT 2POS 2.5MM; Current Rating: 3A; Voltage Rating: 250V; Number of Contacts: 2; Contact Resistance: 20mR; Wire/Cable Gauge: 22AWG; Insulation Resistance: 1GR; Connector Type: Male Pin; Packaging: Bulk; Contact Material: Brass; Lead Free: Lead Free; Orientation: Straight; Contact Plating: Tin; Max Current Rating: 3A; Termination: Solder; Fastening Type: Detent; Depth: 5.75mm; Housing Material: Polyamide; REACH SVHC: No SVHC; Series: XH; Voltage Rating (AC): 250V; Number of Positions: 2; Color: Natural; Contact Type: Male Pin; Max Voltage Rating (DC): 250V; Pitch: 2.5mm; Lead Pitch: 2.5mm; Mount: Through Hole; Max Operating Temperature: 85°C; Length: 7.4mm; Max Voltage Rating (AC): 250V; Min Operating Temperature: -25°C; Number of Rows: 1; Housing Color: White
R9-R24 = 0008051021: RES, size 0805, 1 KOhm, 1/8 W; Manufacture  Name: Vishay Dale; Manufacture  SN: M55342K06B1E00RS3; Resistance tolerance: +/-1%; Rated Power: 1/8 W; Resistance: 1 KOhm; Size: 0805; Mounting Technology: SMT; Supplier 1 Name: Mouser; Supplier 1 SN: N/A; Supplier 1 URL: N/A; Supplier 2 Name: Digi-Key; Supplier 2 SN: 1135-1001-2-ND; Supplier 2 URL: https://www.digikey.com/en/products/detail/vishay-dale/M55342K06B1E00RS3/2941798; Supplier 3 Name: Thegioiic; Supplier 3 SN: N/A; Supplier 3 URL: https://www.thegioiic.com/dien-tro-1-kohm-0805-1; Value: 1 KOhm, 1/8 W; ComponentLink1Description: Datasheet link; ComponentLink1URL: https://www.vishay.com/docs/31010/rcwpm.pdf; ComponentLink2Description: Supplier 1 URL; ComponentLink2URL: N/A; ComponentLink3Description: Supplier 2 URL; ComponentLink3URL: https://www.digikey.com/en/products/detail/vishay-dale/M55342K06B1E00RS3/2941798; ComponentLink4Description: Supplier 3 URL; ComponentLink4URL: https://www.thegioiic.com/dien-tro-1-kohm-0805-1
U2 U3 = CMP-1620-00193-3: IC TRANSCVR NON-INVERT 6V 20SOIC; Logic Function: Transceiver; Number of Circuits: 8; High Level Output Current: -7.8mA; Min Supply Voltage: 2V; Direction: Bidirectional; Propagation Delay: 335ns; Number of Elements: 1; Operating Supply Voltage: 5V; Polarity: Non-Inverting; Quiescent Current: 8uA; Low Level Output Current: 7.8mA; Number of Channels: 8; Width: 7.52mm; Length: 12.8mm; Case/Package: SOIC; Lead Free: Lead Free; Max Supply Voltage: 6V; Max Operating Temperature: 85°C; Mount: Surface Mount; Weight: 0.017662oz; Height: 2.35mm; Contact Plating: Gold; Package Quantity: 1; RoHS Compliant: Yes; Min Operating Temperature: -40°C; Packaging: Tape and Reel; Number of Bits per Element: 8; Number of Outputs: 8; Number of Bits: 8; Number of Pins: 20; REACH SVHC: No SVHC; Turn-On Delay Time: 335ns; Radiation Hardening: No